# Altium schematic sheet Aquarium_LED_Driver.SchDoc
size A4
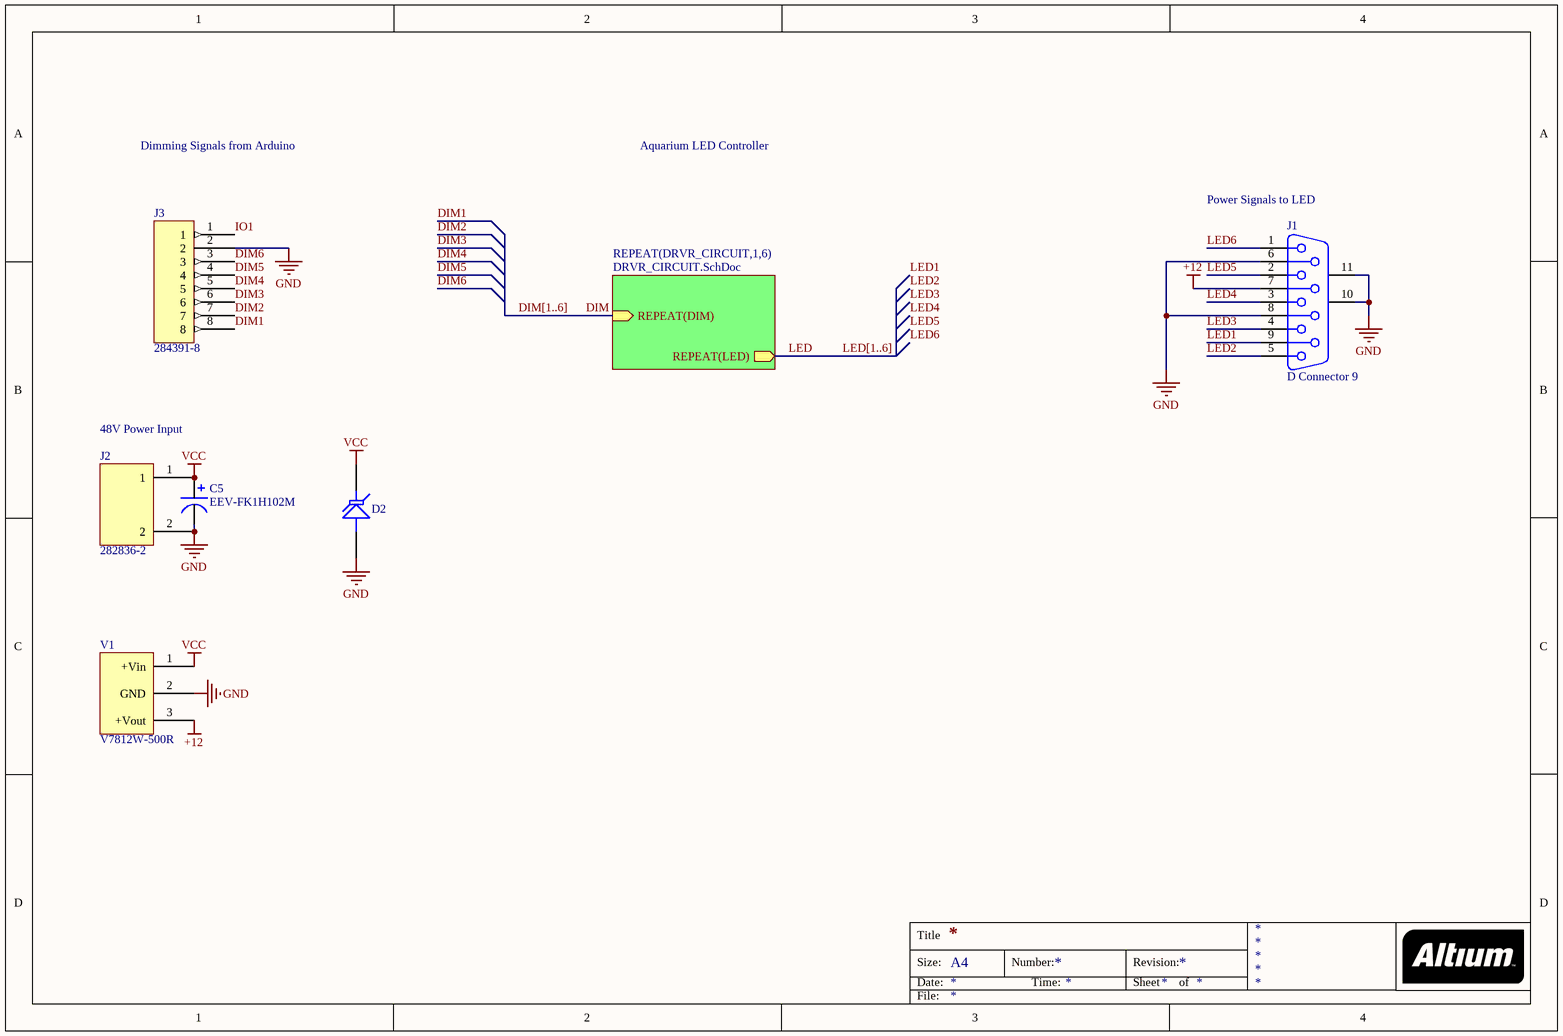
[diagram p0: Aquarium_LED_Driver.SchDoc]

## Parts
C5  EEV-FK1H102M  [EEV-FK1H102M]
D2  Tranzorb  [SMB]  (value not drawn)
J1  D Connector 9  [DSUB1.385-2H9]
J2  282836-2  [282836-2]
J3  284391-8  [284391-8]
V1  V7812W-500R  [V7812W-500R]

## Sub-sheets
REPEAT(DRVR_CIRCUIT,1,6) = DRVR_CIRCUIT.SchDoc: REPEAT(LED) (out), REPEAT(DIM) (in)

## Nets
+12: J1.7 V1.3(+Vout)
GND: C5.1(-) D2.1(A) J1.6 J1.8 J1.10(MH1) J1.11(MH2) J2.2 J3.2 V1.2(GND)
VCC: C5.2(+) D2.2(K) J2.1 V1.1(+Vin)
DIM: sheet REPEAT(DRVR_CIRCUIT,1,6)/REPEAT(DIM)
DIM1: J3.8
DIM2: J3.7
DIM3: J3.6
DIM4: J3.5
DIM5: J3.4
DIM6: J3.3
IO1: J3.1
LED: sheet REPEAT(DRVR_CIRCUIT,1,6)/REPEAT(LED)
LED1: J1.9
LED2: J1.5
LED3: J1.4
LED4: J1.3
LED5: J1.2
LED6: J1.1

## Buses and harness runs
bus DIM[1..6]
bus LED[1..6]

## Notes on the sheet
- Dimming Signals from Arduino
- Aquarium LED Controller
- (near J1) Power Signals to LED
- 48V Power Input
- Labels drawn without touching a wire or pin: LED1, LED2, LED3, LED4, LED5, LED6
- Title
- Size:
- Date:
- A4
- Number:
- Time:
- Revision:
- Sheet
- of
- File:

## Library data of the parts
C5 = EEV-FK1H102M: Aluminum Electrolytic Capcitor
D2 = Tranzorb: Transient Voltage Suppression (TVS) Diode; Published: 24-Mar-1999; LatestRevisionDate: 17-Jul-2002; LatestRevisionNote: Re-released for DXP Platform.; PackageReference: DO-7; Publisher: Altium Limited; PackageDescription: Axial Lead Diode
J1 = D Connector 9: Receptacle Assembly, 9 Position, Right Angle; PackageDocument: O; Positions: 9; Published: 15-Jun-2001; LatestRevisionDate: 17-Jul-2002; LatestRevisionNote: Re-released for DXP Platform.; DatasheetDocument: 1-Sep-1999; PackageReference: 788750; Publisher: Altium Limited; Orientation: Right Angle; Gender: Receptacle
J2 = 282836-2: Board Mount w/Interlock,  Low Profile,  5.0 mm Centerline,  Side Wire Entry
J3 = 284391-8: 8-Pos Eurostyle Terminal Block